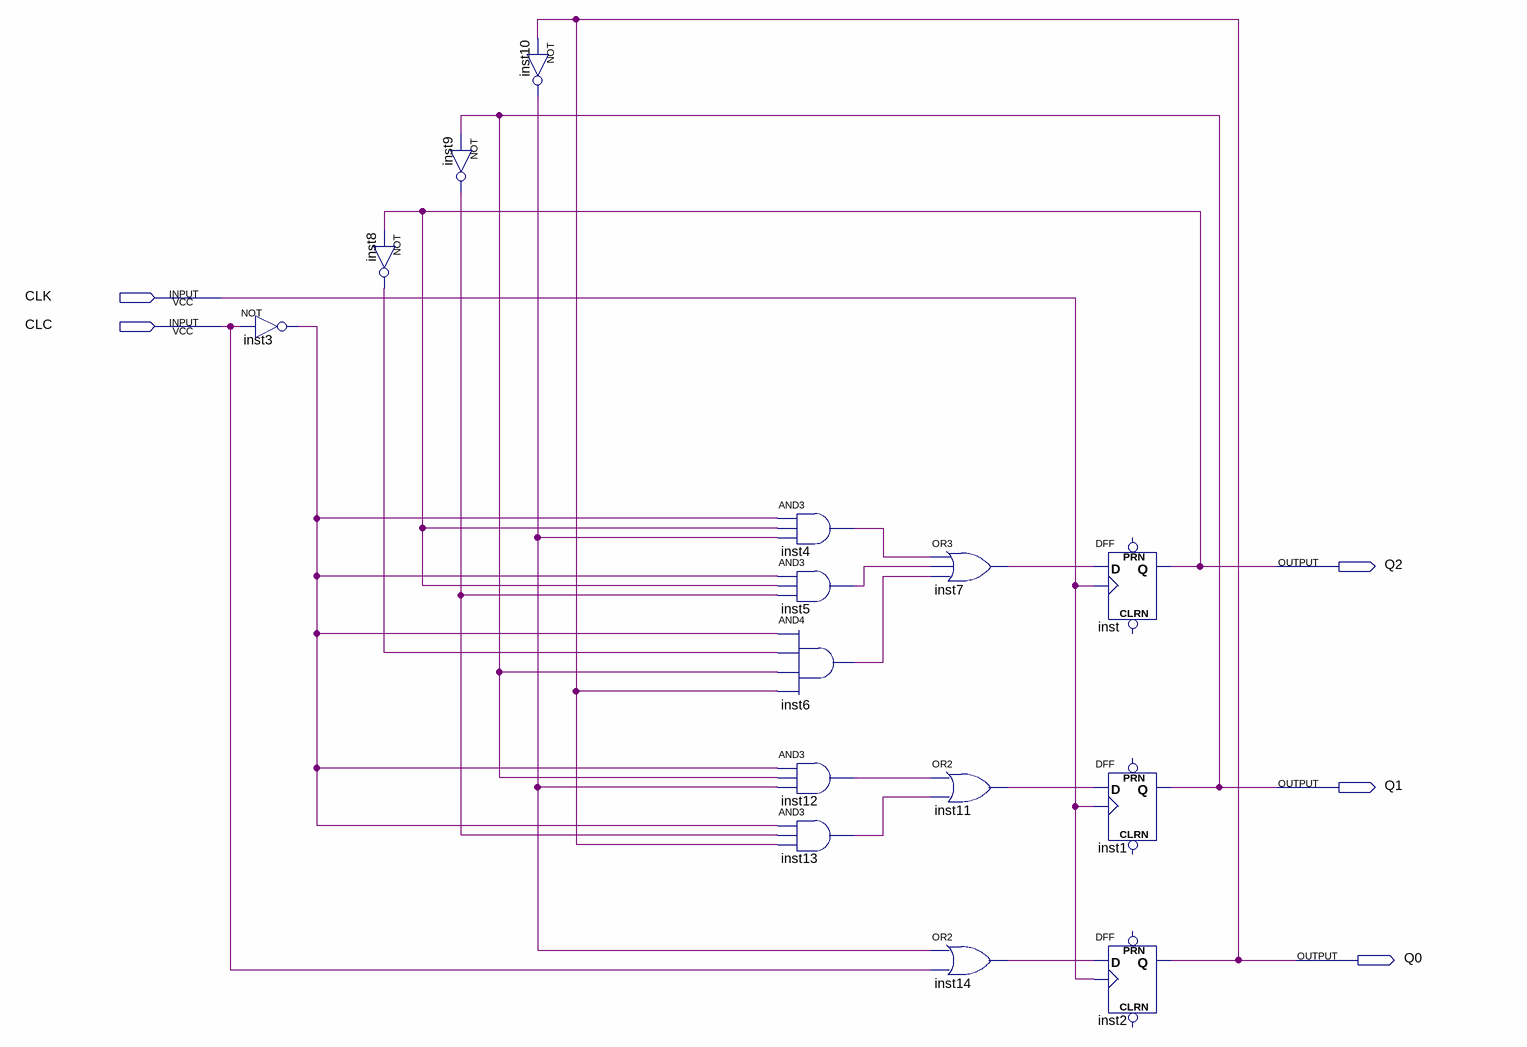
[diagram p0: schematic sheet]
// Quartus schematic Contador.bdf as structural Verilog: 15 symbols, 5 pins
module Contador (
  input  CLK,
  input  CLC,
  output Q2,
  output Q1,
  output Q0
);

  wire inst3_out, inst4_out, inst5_out, inst6_out, inst7_out, inst8_out, inst9_out, inst10_out, inst11_out,
       inst12_out, inst13_out, inst14_out;

  not inst3 (inst3_out, CLC);
  not inst8 (inst8_out, Q2);
  not inst9 (inst9_out, Q1);
  not inst10 (inst10_out, Q0);
  and inst4 (inst4_out, inst3_out, Q2, inst10_out);
  and inst5 (inst5_out, inst3_out, Q2, inst9_out);
  and inst6 (inst6_out, inst3_out, inst8_out, Q1, Q0);
  and inst12 (inst12_out, inst3_out, Q1, inst10_out);
  and inst13 (inst13_out, inst3_out, inst9_out, Q0);
  or inst7 (inst7_out, inst4_out, inst5_out, inst6_out);
  or inst11 (inst11_out, inst12_out, inst13_out);
  or inst14 (inst14_out, inst10_out, CLC);
  DFF inst (.CLK(CLK), .D(inst7_out), .Q(Q2));  // open: CLRN, PRN
  DFF inst1 (.CLK(CLK), .D(inst11_out), .Q(Q1));  // open: CLRN, PRN
  DFF inst2 (.CLK(CLK), .D(inst14_out), .Q(Q0));  // open: CLRN, PRN
endmodule
